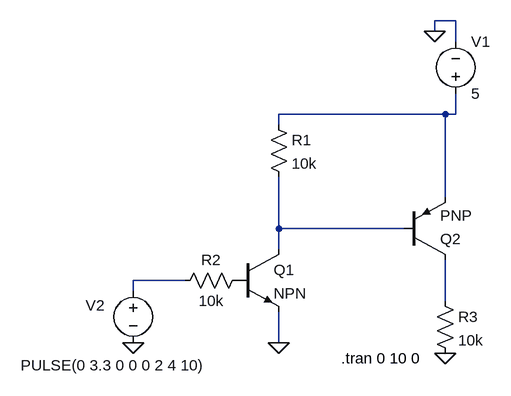
[diagram p0: schematic High side transistor switch.asc]
High side transistor switch.asc, the LTspice schematic file:
Version 4
SHEET 1 880 680
WIRE 64 -192 32 -192
WIRE 32 -176 32 -192
WIRE 64 -160 64 -192
WIRE 48 -48 -208 -48
WIRE 64 -48 64 -80
WIRE 64 -48 48 -48
WIRE -208 -32 -208 -48
WIRE 48 80 48 -48
WIRE -208 128 -208 48
WIRE -16 128 -208 128
WIRE -208 160 -208 128
WIRE -352 208 -432 208
WIRE -432 224 -432 208
WIRE 48 240 48 176
WIRE -208 304 -208 256
FLAG -432 304 0
FLAG -208 304 0
FLAG 48 320 0
FLAG 32 -176 0
SYMBOL voltage -432 208 R0
WINDOW 0 -73 38 Left 2
WINDOW 3 -173 131 Left 2
WINDOW 123 0 0 Left 0
WINDOW 39 0 0 Left 0
SYMATTR InstName V2
SYMATTR Value PULSE(0 3.3 0 0 0 2 4 10)
SYMBOL npn -272 160 R0
SYMATTR InstName Q1
SYMBOL res -256 192 R90
WINDOW 0 0 56 VBottom 2
WINDOW 3 32 56 VTop 2
SYMATTR InstName R2
SYMATTR Value 10k
SYMBOL res -224 -48 R0
SYMATTR InstName R1
SYMATTR Value 10k
SYMBOL pnp -16 176 M180
SYMATTR InstName Q2
SYMBOL res 32 224 R0
SYMATTR InstName R3
SYMATTR Value 10k
SYMBOL voltage 64 -64 M180
WINDOW 0 24 96 Left 2
WINDOW 3 24 16 Left 2
WINDOW 123 0 0 Left 0
WINDOW 39 0 0 Left 0
SYMATTR InstName V1
SYMATTR Value 5
TEXT -112 328 Left 2 !.tran 0 10 0

The netlist it stands for:
* High side transistor switch.asc
V2 N003 0 PULSE(0 3.3 0 0 0 2 4 10)
Q1 N002 P001 0 0 NPN
R2 P001 N003 10k
R1 N001 N002 10k
Q2 N004 N002 N001 0 PNP
R3 N004 0 10k
V1 N001 0 5
.model NPN NPN
.model PNP PNP
.lib standard.bjt
.tran 0 10 0
.backanno
.end